# Altium schematic sheet Power_management.SchDoc: Power management
size Letter; DrawnBy: D. Fusi; DocumentNumber: 1; Revision: PVT; SheetNumber: 1; SheetTotal: 3
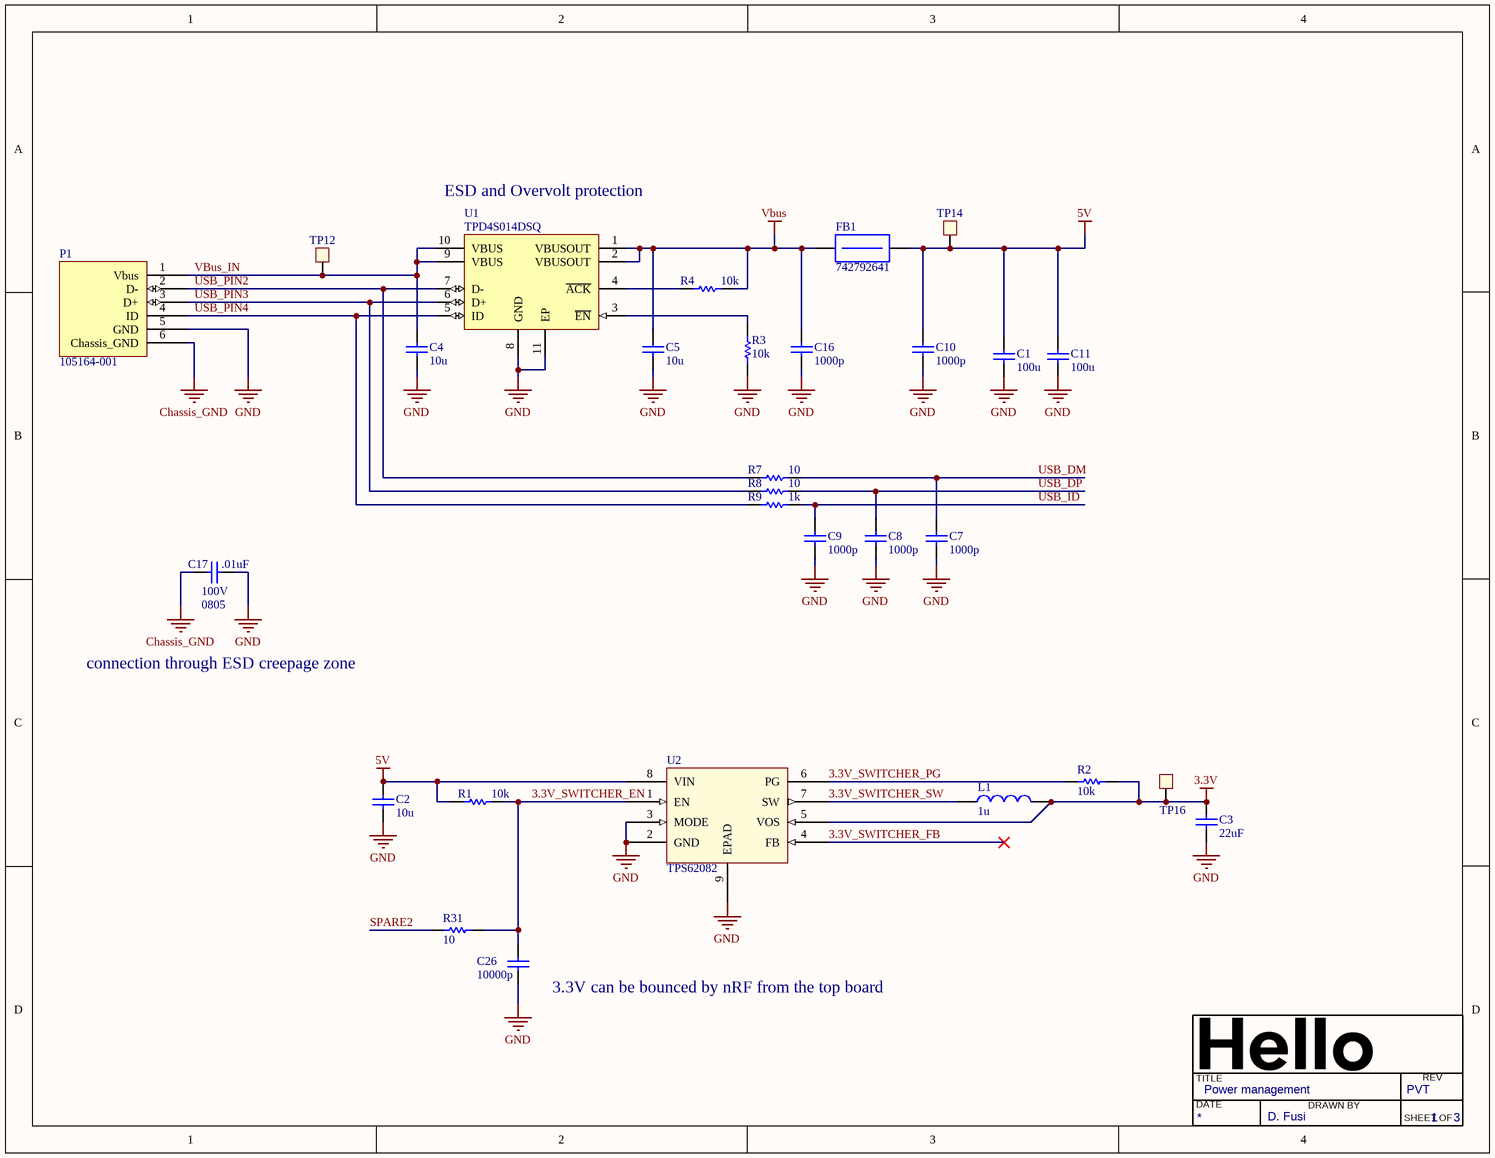
[diagram p0: Power_management.SchDoc]

## Parts
C1  100u  [CAP1206_SENSE_DVT]
C2  10u  [CAP0603_SENSE_DVT]
C3  22uF  [CAP1206_SENSE_DVT]
C4  10u  [CAP0603_SENSE_DVT]
C5  10u  [CAP0805_SENSE_DVT]
C7  1000p  [CAP0402_SENSE_DVT]
C8  1000p  [CAP0402_SENSE_DVT]
C9  1000p  [CAP0402_SENSE_DVT]
C10  1000p  [CAP0402_SENSE_DVT]
C11  100u  [CAP1206_SENSE_DVT]
C16  1000p  [CAP0402_SENSE_DVT]
C17  .01uF  Size: 0805  Voltage: 100V  [CAP0805_SENSE_DVT]
C26  10000p  [CAP0402_SENSE_DVT]
FB1  742792641  [RES0603_SENSE_DVT]
L1  1u  [INDC3030X13N]
P1  105164-001  [molex_105164-001]
R1  10k  [RES0402_SENSE_DVT]
R2  10k  [RES0402_SENSE_DVT]
R3  10k  [RES0402_SENSE_DVT]
R4  10k  [RES0402_SENSE_DVT]
R7  10  [RES0402_SENSE_DVT]
R8  10  [RES0402_SENSE_DVT]
R9  1k  [RES0402_SENSE_DVT]
R31  10  [RES0402_SENSE_DVT]
TP12  TP  [TP-1.1]  (value not drawn)
TP14  TP  [TP-1.1]  (value not drawn)
TP16  TP  [TP-1.1]  (value not drawn)
U1  TPD4S014DSQ  [DSQ10-1500X900TP]
U2  TPS62082  [QFN50P200X200X80_HS-9N]

## Nets
3.3V: C3.2 L1.2 R2.1 TP16.1 U2.5(VOS)
5V: C1.2 C2.2 C10.2 C11.2 FB1.2 R1.2 TP14.1 U2.8(VIN)
Chassis_GND: C17.1 P1.6(Chassis_GND)
GND: C1.1 C2.1 C3.1 C4.1 C5.1 C7.1 C8.1 C9.1 C10.1 C11.1 C16.1 C17.2 C26.1 P1.5(GND) R3.2 U1.8(GND) U1.11(EP) U2.2(GND) U2.3(MODE) U2.9(EPAD)
Vbus: C5.2 C16.2 FB1.1 R4.2 U1.1(VBUSOUT) U1.2(VBUSOUT)
3.3V_SWITCHER_EN: C26.2 R1.1 R31.2 U2.1(EN)
3.3V_SWITCHER_FB: U2.4(FB)
3.3V_SWITCHER_PG: R2.2 U2.6(PG)
3.3V_SWITCHER_SW: L1.1 U2.7(SW)
SPARE2: R31.1
USB_DM: C7.2 R7.1
USB_DP: C8.2 R8.1
USB_ID: C9.2 R9.2
USB_PIN2: P1.2(D-) R7.2 U1.7(D-)
USB_PIN3: P1.3(D+) R8.2 U1.6(D+)
USB_PIN4: P1.4(ID) R9.1 U1.5(ID)
VBus_IN: C4.2 P1.1(Vbus) TP12.1 U1.9(VBUS) U1.10(VBUS)
NetR3_1: R3.1 U1.3(~{EN})
NetR4_1: R4.1 U1.4(~{ACK})

## Notes on the sheet
- (near U1) ESD and Overvolt protection
- connection through ESD creepage zone
- (near C26) 3.3V can be bounced by nRF from the top board
- TITLE
- DATE
- DRAWN BY
- REV
- SHEET
- OF

## Library data of the parts
C1 C11 = C_100u_20_10_X5R_1206: CAP CER 10UF 10V 20% X5R 1206; Vendor: Taiyo Yuden; PN: LMK316BBJ107ML-T; Hello_PN: 225-00304; item_category: Capacitor; Value: 100u; Size: 1206; Tolerance: 20%; Voltage: 10V; Temp: X5R
C2 C4 = C_10u_20_10_X5R_0603: CAP CER 10UF 10V 20% X5R 0603; Vendor: Samsung; PN: CL10A106MP8NNNC; Hello_PN: 225-00397; Value: 10u; Size: 0603; Tolerance: 20%; Voltage: 10V; Temp: X5R
C3 = C_22u_20_10_X5R_1206: CAP CER 22UF 10V 20% X5R 1206; Value: 22u; Vendor: Yageo; PN: CC1206MKX5R6BB226; Hello_PN: 225-00368; item_category: Capacitor; Size: 1206; Tolerance: 20%; Voltage: 10V; Temp: X5R
C5 = C_10u_20_10_X7R_0805: CAP CER 10UF 10V 10% X7R 0805; Vendor: Samsung; PN: CL21B106KPQNNNE; Tolerance: 20%; Hello_PN: 225-00413; item_category: Capacitor; Value: 10u; Size: 0805; Voltage: 10V; Temp: X7R
C7-C10 C16 = C_1000p_10_50_X7R_0402: CAP CER 1000PF 50V 10% X7R 0402; Vendor: Yageo; PN: CC0402KRX7R9BB102; Hello_PN: 225-00272; item_category: Capacitor; Value: 1000p; Size: 0402; Tolerance: 10%; Voltage: 50V; Temp: X7R
C17 = C_10000p_10_100_X7R_0805: CAP CER 10000PF 100V X7R 0805; Vendor: TDK; PN: C2012X7R2A103K085AA; Tolerance: 10%; Hello_PN: 225-00307; item_category: Capacitor; Value: .01uF; Temp: X7R
C26 = C_10000p_10_50_X7R_0402: CAP CER 10000PF 50V 10% X7R 0402; Vendor: Yageo; PN: CC0402KRX7R9BB103; Voltage: 50; item_category: Capacitor; Hello_PN: 225-00349; Value: 10000p; Size: 0402; Tolerance: 10%; Temp: X7R
FB1 = FB_300_2_0.15_0603: FERRITE BEAD 300 OHM 2.0A 0603; Vendor: Wuerth; impedance at 100 MHz: 300; rated current: 2 A; DCR: 0.15 ohm; Hello_PN: 231-00206; PN: 742792641; item_category: Ferrite Bead
L1 = L_1u_20_?_0.39_1.4_2.5_1: SMD power inductor, 1uH; PN: XFL3012-102ME; Vendor: Coilcraft; Tolerance: 20%; RDC: 0.39; I_max: 2.5; I_sat: 1.4; Hello_PN: 230-00357; Value: 1u; Q: ?
P1 = molex_105164-001: Molex right-angle reverse flangeless USB Mini-B OTG receptacle; Hello_PN: 280-00265; item_category: Connector; PN: 105164-001; Vendor: Molex
R1-R4 = R_10k_5_0.1_0402: RES SMD 10K OHM 5% 1/16W 0402; Vendor: Yageo; PN: RC0402JR-0710KL; Hello_PN: 220-00409; item_category: Resistor; Model: *; Value: 10k; Tolerance: 5 %; Power: 1/16W; Size: 0402
R7 R8 R31 = R_10_1_0.1_0402: RES SMD 10 OHM 1% 1/16W 0402; Vendor: Yageo; PN: RC0402FR-0710RL; Hello_PN: 220-00405; item_category: Resistor; Model: *; Value: 10; Tolerance: 1 %; Power: 1/16W; Size: 0402
R9 = R_1k_1_0.1_0402: RES SMD 1K OHM 1% 1/16W 0402; Vendor: Yageo; PN: RC0402FR-071KL; item_category: Resistor; Hello_PN: 220-00402; Model: *; Value: 1k; Tolerance: 1 %; Power: 1/16W; Size: 0402
TP12 TP14 TP16 = TP: testpoint
U1 = TPD4S014DSQ: TPD4S014 USB Charger Port Protection Including ESD Protection for all Lines and Over Voltage Protection on VBUS. D+/D-/ID pins are interchangable.; Vendor: Texas Instruments; Hello_PN: 260-00375; item_category: IC Analog; Supplier 1: Digi-Key; Supplier Part Number 1: 296-29093-1-ND; PN: TPD4S014DSQ
U2 = TPS62082: 1.2A buck converter with snoozemode; Vendor: TI; Hello_PN: 260-00360; item_category: IC Analog; PN: TPS62082